# Altium schematic sheet CD74HC4067_MUX_2.SchDoc
size A
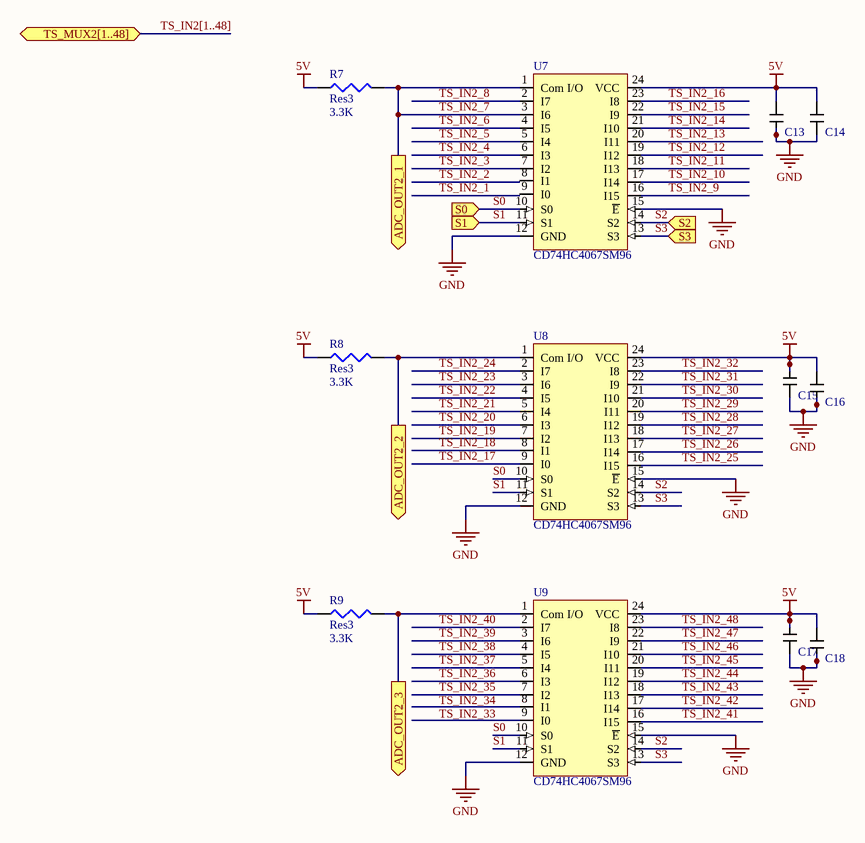
[diagram p0: CD74HC4067_MUX_2.SchDoc]

## Parts
C13  0.1uF Cap  [CAPC1608X09M]  (value not drawn)
C14  1uF Samsung Cap  [CAPC1608X09M]  (value not drawn)
C15  0.1uF Cap  [CAPC1608X09M]  (value not drawn)
C16  1uF Samsung Cap  [CAPC1608X09M]  (value not drawn)
C17  0.1uF Cap  [CAPC1608X09M]  (value not drawn)
C18  1uF Samsung Cap  [CAPC1608X09M]  (value not drawn)
R7  Res3  value 3.3K  [J1-0603]
R8  Res3  value 3.3K  [J1-0603]
R9  Res3  value 3.3K  [J1-0603]
U7  CD74HC4067SM96  [SOIC-24_MUX]
U8  CD74HC4067SM96  [SOIC-24_MUX]
U9  CD74HC4067SM96  [SOIC-24_MUX]

## Ports
ADC_OUT2_1 (out), ADC_OUT2_2 (out), ADC_OUT2_3 (out), S0 (in), S1 (in), S2 (in), S3 (in), TS_MUX2[1..48] (bidir)

## Nets
5V: C13.2 C14.2 C15.2 C16.2 C17.2 C18.2 R7.1 R8.1 R9.1 U7.24(VCC) U8.24(VCC) U9.24(VCC)
GND: C13.1 C14.1 C15.1 C16.1 C17.1 C18.1 U7.12(GND) U7.15(~{E}) U8.12(GND) U8.15(~{E}) U9.12(GND) U9.15(~{E})
ADC_OUT2_2: R8.2 U8.1(Com_I/O) ; port ADC_OUT2_2
ADC_OUT2_3: R9.2 U9.1(Com_I/O) ; port ADC_OUT2_3
S0: U7.10(S0) U8.10(S0) U9.10(S0) ; port S0
S1: U7.11(S1) U8.11(S1) U9.11(S1) ; port S1
S2: U7.14(S2) U8.14(S2) U9.14(S2) ; port S2
S3: U7.13(S3) U8.13(S3) U9.13(S3) ; port S3
TS_IN2_3: U7.7(I2)
TS_IN2_4: U7.6(I3)
TS_IN2_5: U7.5(I4)
TS_IN2_6: U7.4(I5)
TS_IN2_7: R7.2 U7.1(Com_I/O) U7.3(I6) ; port ADC_OUT2_1
TS_IN2_8: U7.2(I7)
TS_IN2_9: U7.16(I15)
TS_IN2_10: U7.17(I14)
TS_IN2_11: U7.18(I13)
TS_IN2_12: U7.19(I12)
TS_IN2_13: U7.20(I11)
TS_IN2_14: U7.21(I10)
TS_IN2_15: U7.22(I9)
TS_IN2_16: U7.23(I8)
TS_IN2_17: U8.9(I0)
TS_IN2_18: U8.8(I1)
TS_IN2_19: U8.7(I2)
TS_IN2_20: U8.6(I3)
TS_IN2_21: U8.5(I4)
TS_IN2_22: U8.4(I5)
TS_IN2_23: U8.3(I6)
TS_IN2_24: U8.2(I7)
TS_IN2_25: U8.16(I15)
TS_IN2_26: U8.17(I14)
TS_IN2_27: U8.18(I13)
TS_IN2_28: U8.19(I12)
TS_IN2_29: U8.20(I11)
TS_IN2_30: U8.21(I10)
TS_IN2_31: U8.22(I9)
TS_IN2_32: U8.23(I8)
TS_IN2_35: U9.7(I2)
TS_IN2_36: U9.6(I3)
TS_IN2_37: U9.5(I4)
TS_IN2_38: U9.4(I5)
TS_IN2_39: U9.3(I6)
TS_IN2_40: U9.2(I7)
TS_IN2_41: U9.16(I15)
TS_IN2_42: U9.17(I14)
TS_IN2_43: U9.18(I13)
TS_IN2_44: U9.19(I12)
TS_IN2_45: U9.20(I11)
TS_IN2_46: U9.21(I10)
TS_IN2_47: U9.22(I9)
TS_IN2_48: U9.23(I8)

Not connected (* = marked no-connect by the designer): U7 8(I1) 9(I0); U9 8(I1) 9(I0)

## Buses and harness runs
bus TS_IN2[1..48] = port TS_MUX2[1..48]

## Notes on the sheet
- Labels drawn without touching a wire or pin: TS_IN2_33, TS_IN2_34

## Library data of the parts
C13 C15 C17 = 0.1uF Cap: C0603C101K8GAC7867 Kemet Capacitor; Supplier 1: Digi-Key; Supplier Part Number 1: 399-14477-1-ND
R7-R9 = Res3: Resistor; Published: 8-Jun-2000; LatestRevisionDate: 29-May-2009; LatestRevisionNote: IPC-7351 Footprint Added.; PackageReference: J1-0603; Publisher: Altium Limited; PackageDescription: Chip Resistor
C14 C16 C18 = 1uF Samsung Cap: Supplier 1: Digi-Key; Supplier Part Number 1: 1276-1946-1-ND
U7-U9 = CD74HC4067SM96: Supplier Part Number 1: 05B6161; Supplier 1: Newark